# Altium schematic sheet Block.SchDoc
size A4; SheetNumber: 2; SheetTotal: 2
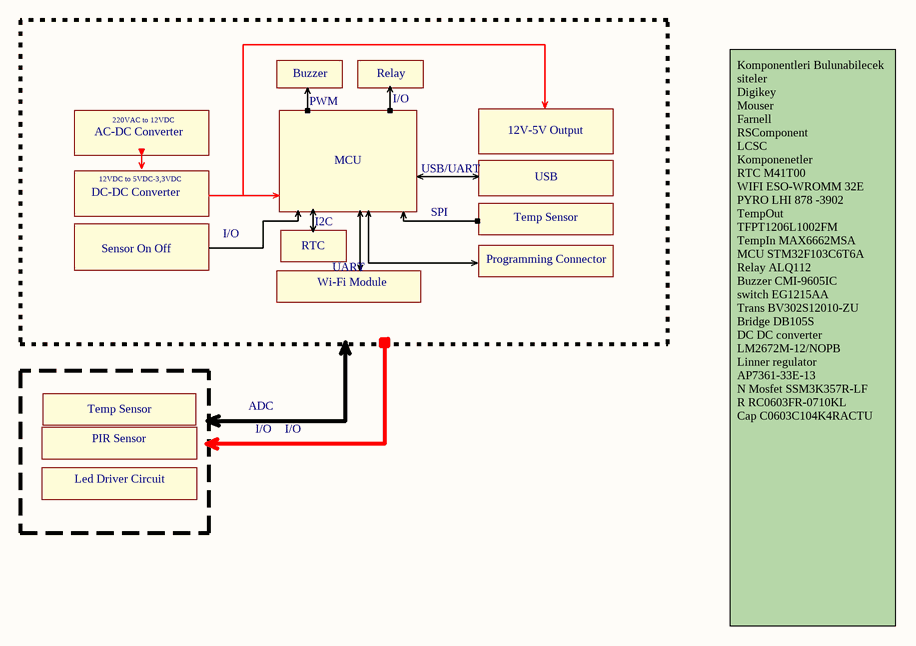
[diagram p0: Block.SchDoc]

## Notes on the sheet
- Buzzer
- Relay
- AC-DC Converter
- 220VAC to 12VDC
- PWM
- I/O
- 12V-5V Output
- DC-DC Converter
- 12VDC to 5VDC-3,3VDC
- I2C
- MCU
- USB/UART
- SPI
- Temp Sensor
- USB
- Sensor On Off
- RTC
- Wi-Fi Module
- UART
- Programming Connector
- ADC
- Led Driver Circuit
- PIR Sensor
- Komponentleri Bulunabilecek siteler
  Digikey
  Mouser
  Farnell
  RSComponent
  LCSC
  Komponenetler
  RTC M41T00
  WIFI ESO-WROMM 32E
  PYRO LHI 878 -3902
  TempOut
  TFPT1206L1002FM
  TempIn MAX6662MSA
  MCU STM32F103C6T6A
  Relay ALQ112
  Buzzer CMI-9605IC
  switch EG1215AA
  Trans BV302S12010-ZU
  Bridge DB105S
  DC DC converter LM2672M-12/NOPB
  Linner regulator AP7361-33E-13
  N Mosfet SSM3K357R-LF
  R RC0603FR-0710KL
  Cap C0603C104K4RACTU